# EAGLE design p8x-control-card (EAGLE 9.6.2)
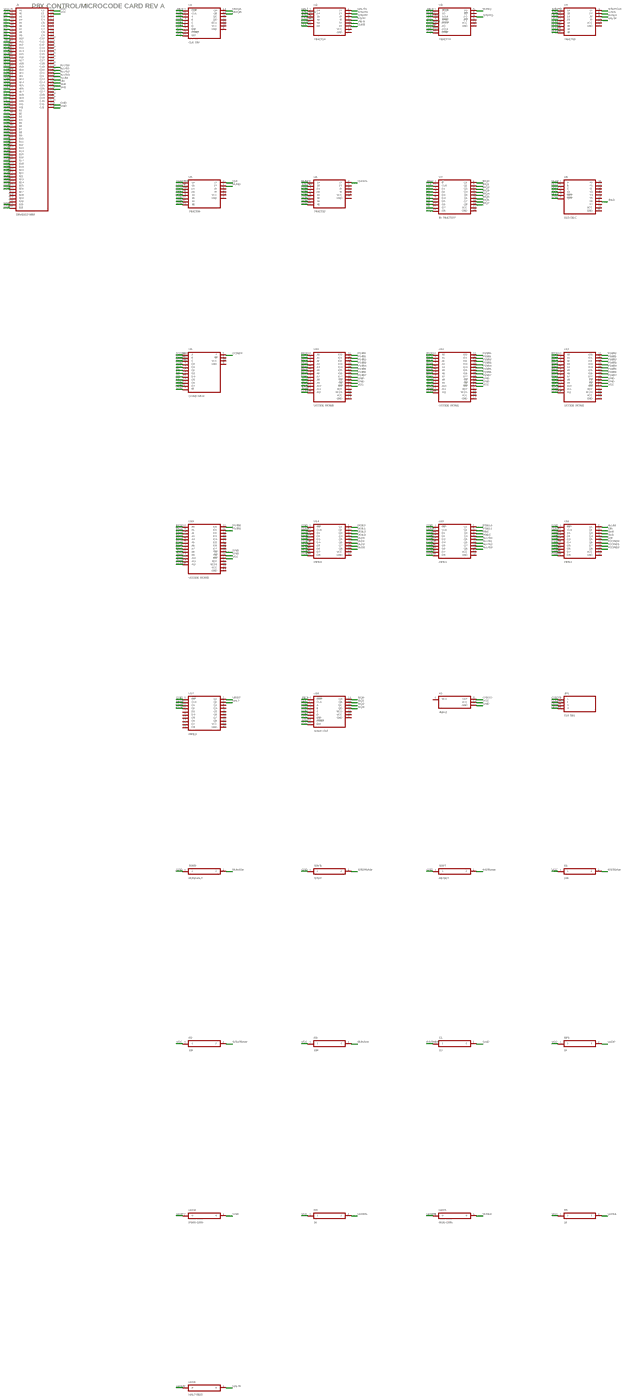
[diagram p0: schematic, sheet 1, overview]
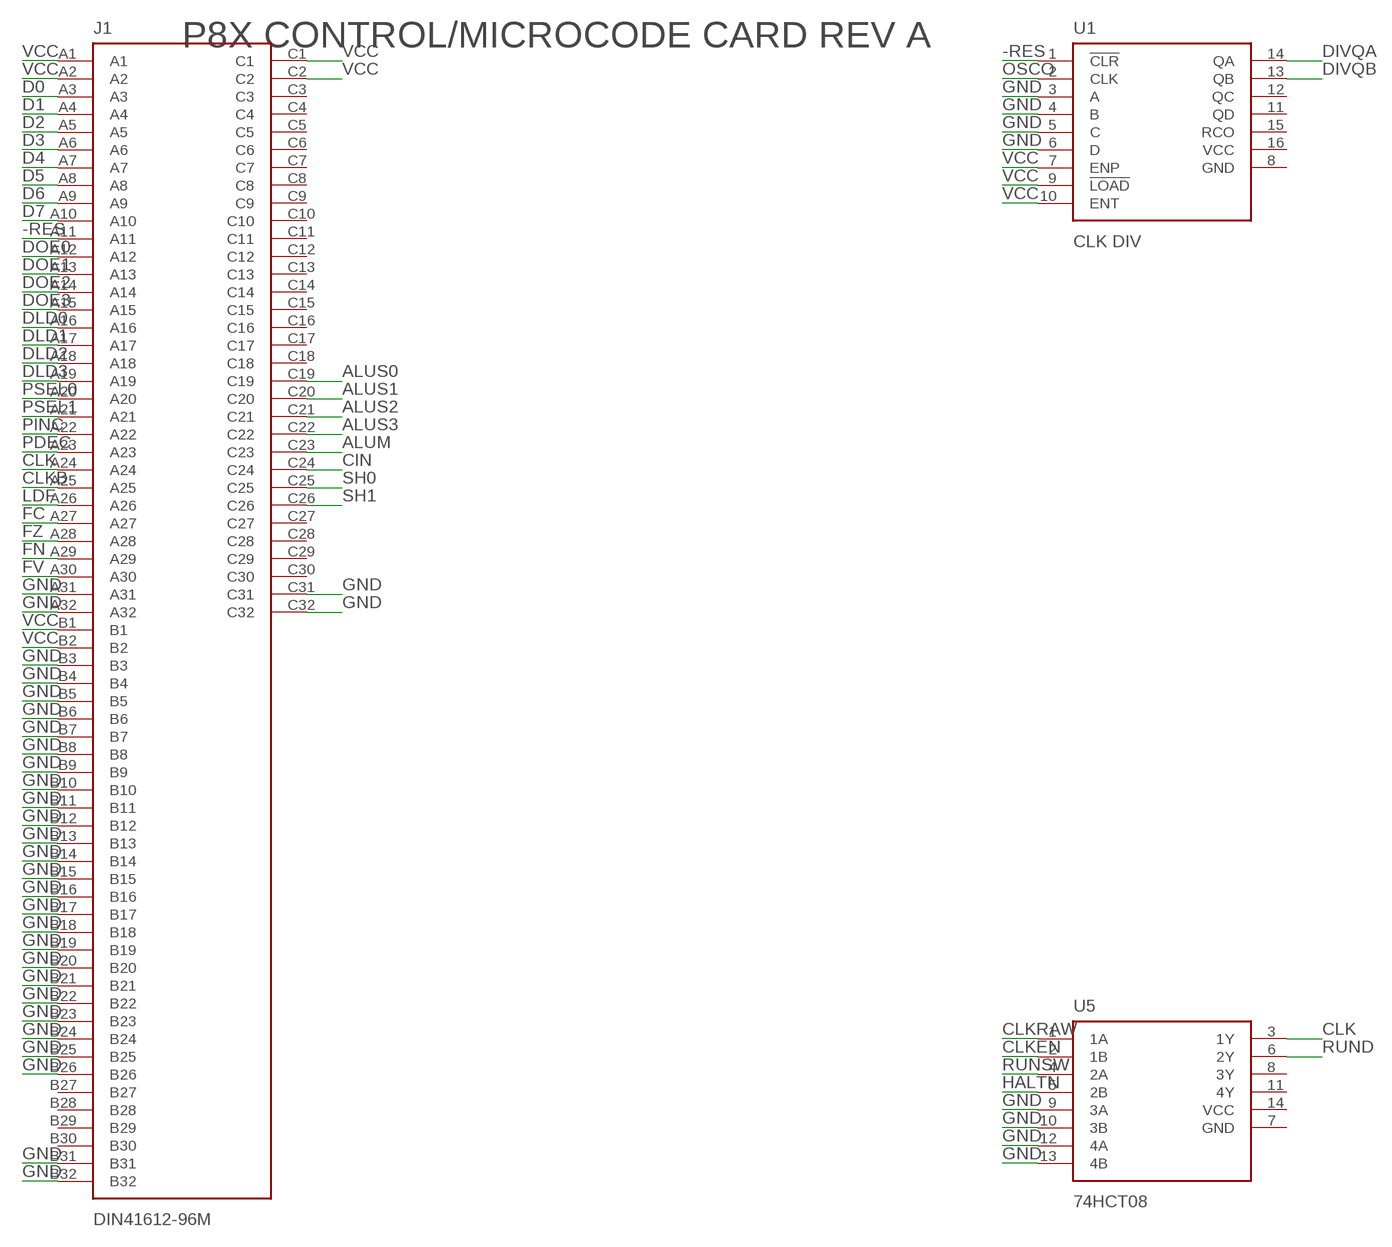
[diagram p1: schematic, sheet 1, part 1 of 5]
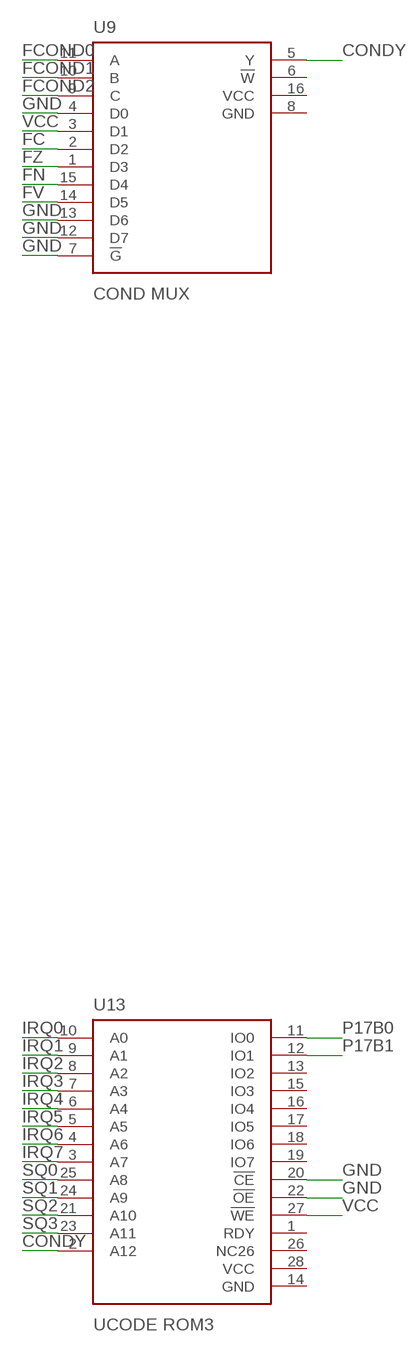
[diagram p2: schematic, sheet 1, part 2 of 5]
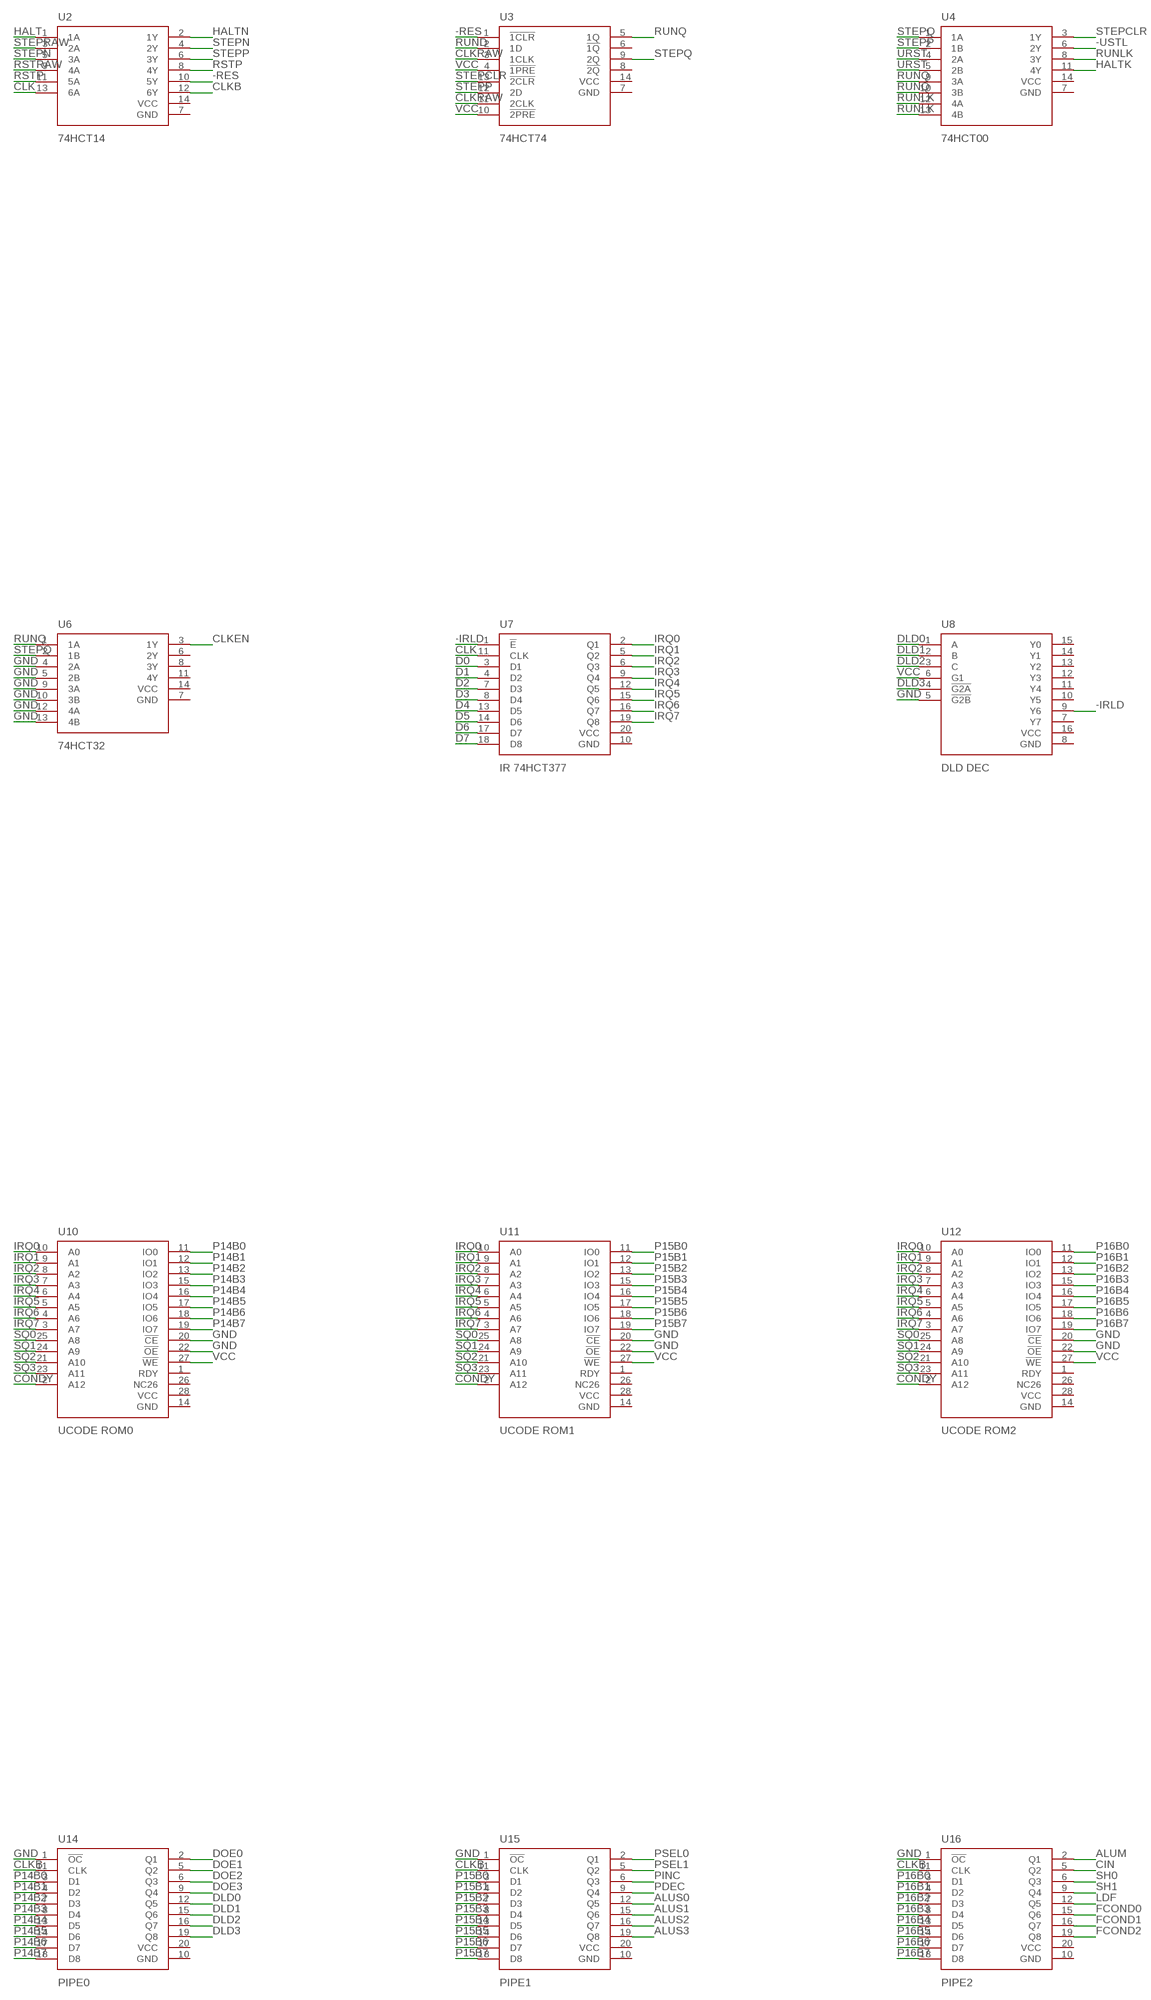
[diagram p3: schematic, sheet 1, part 3 of 5]
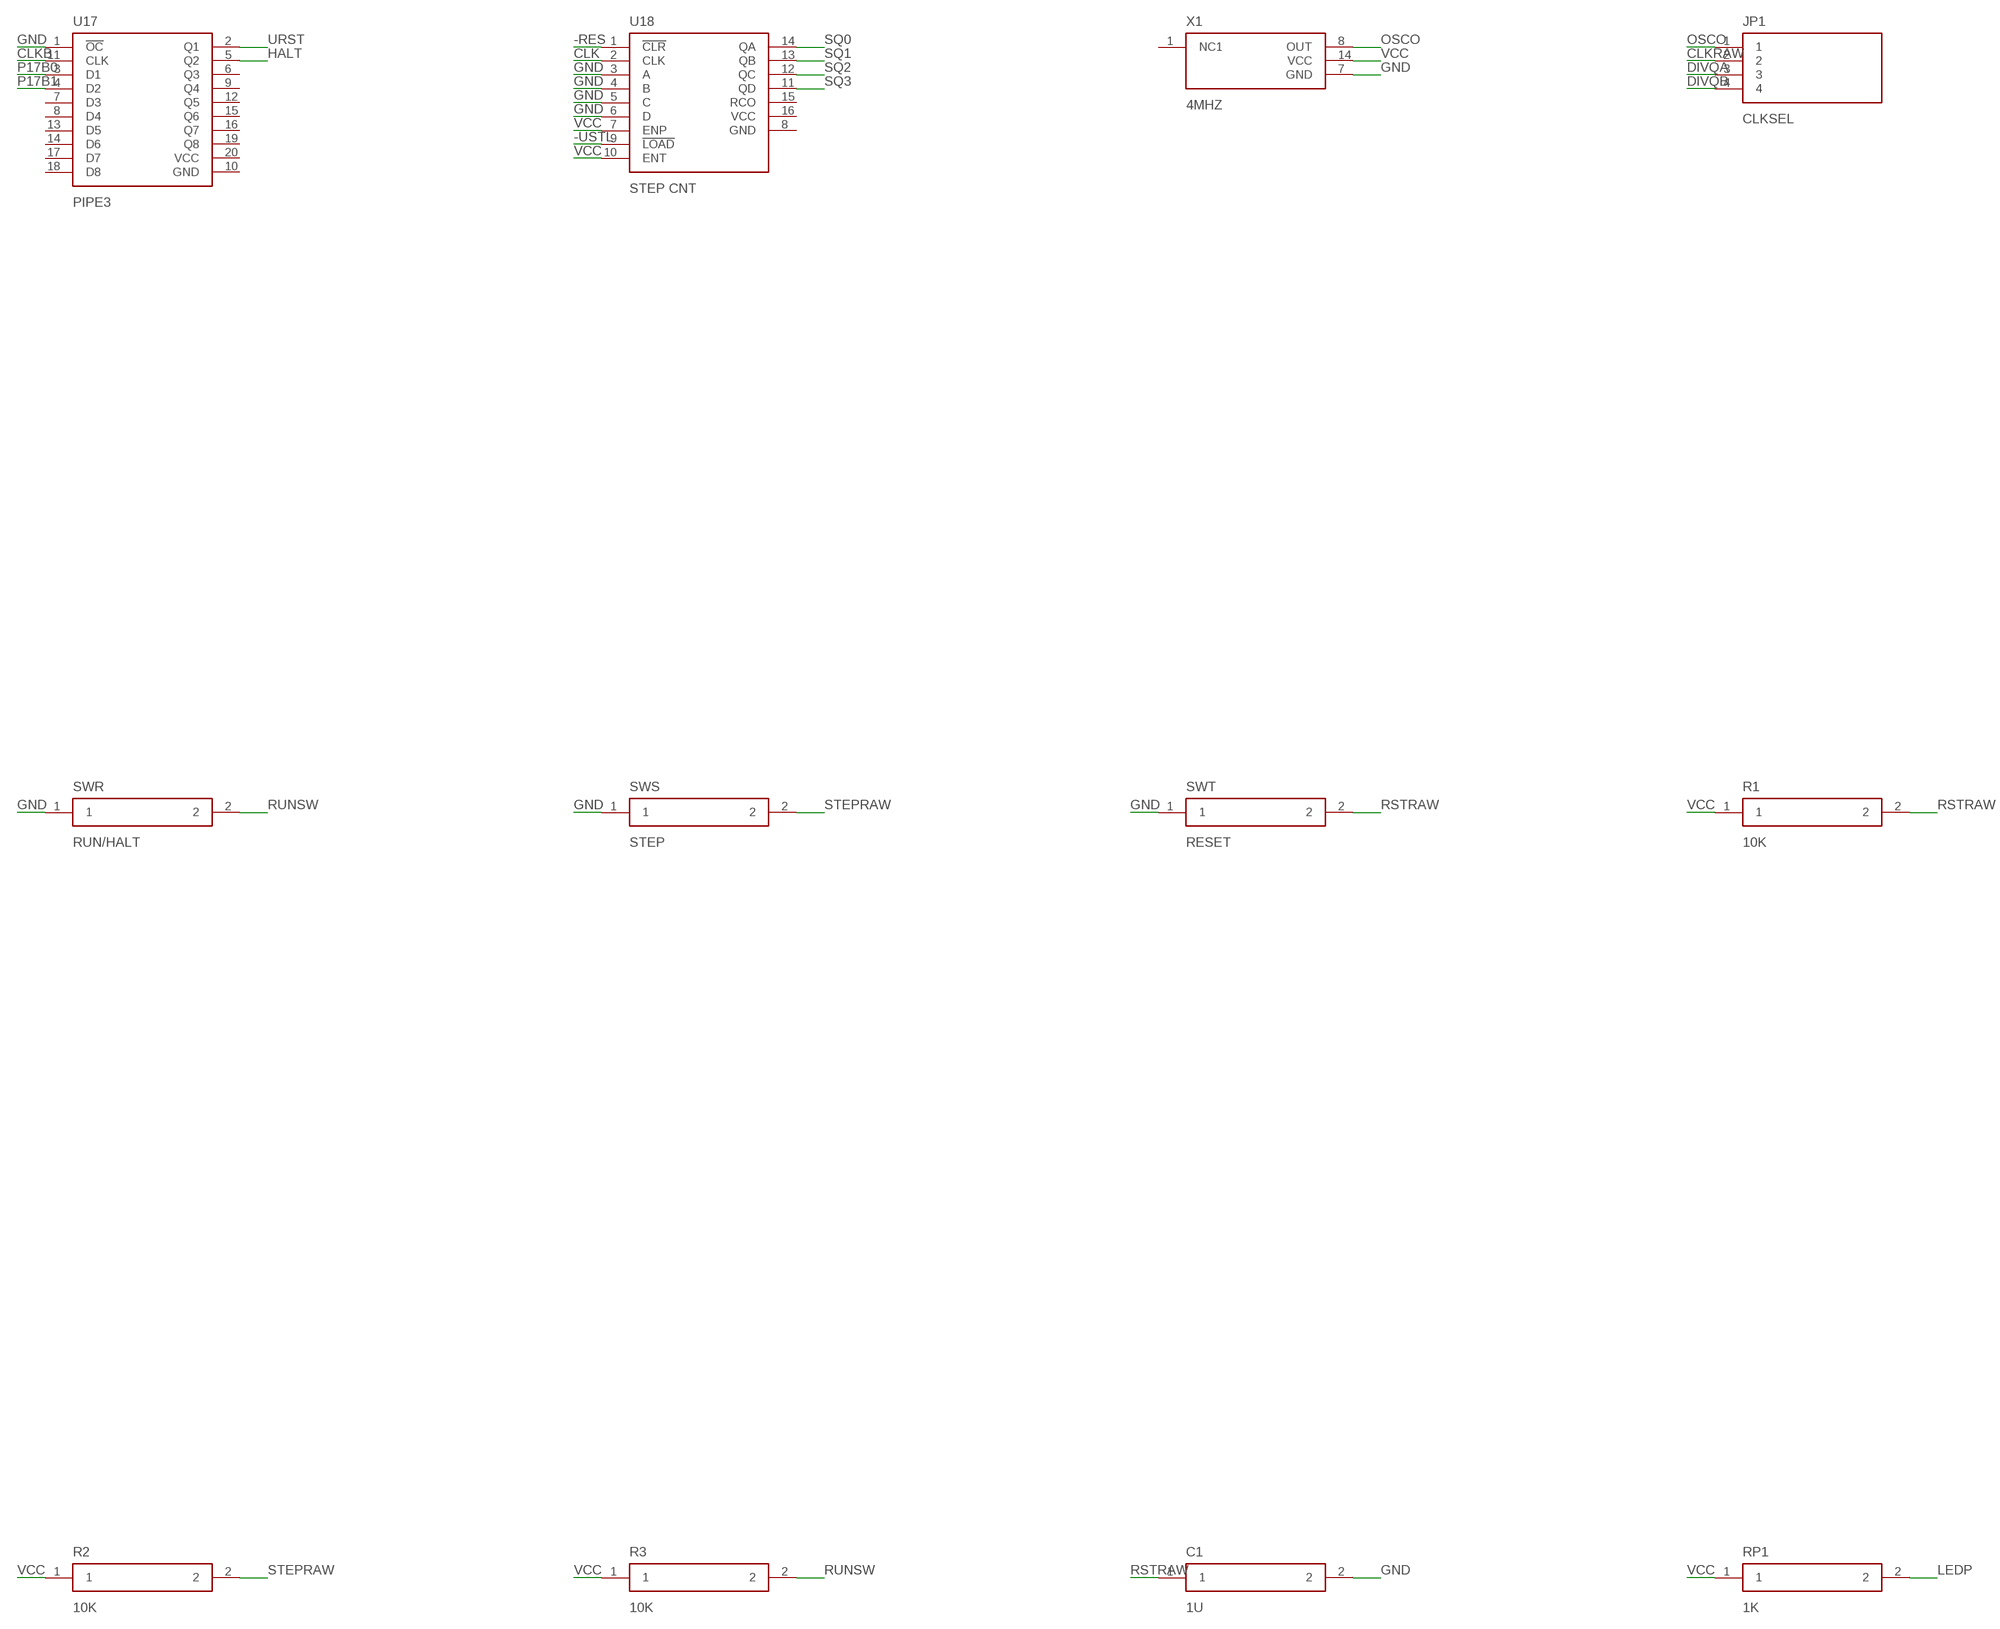
[diagram p4: schematic, sheet 1, part 4 of 5]
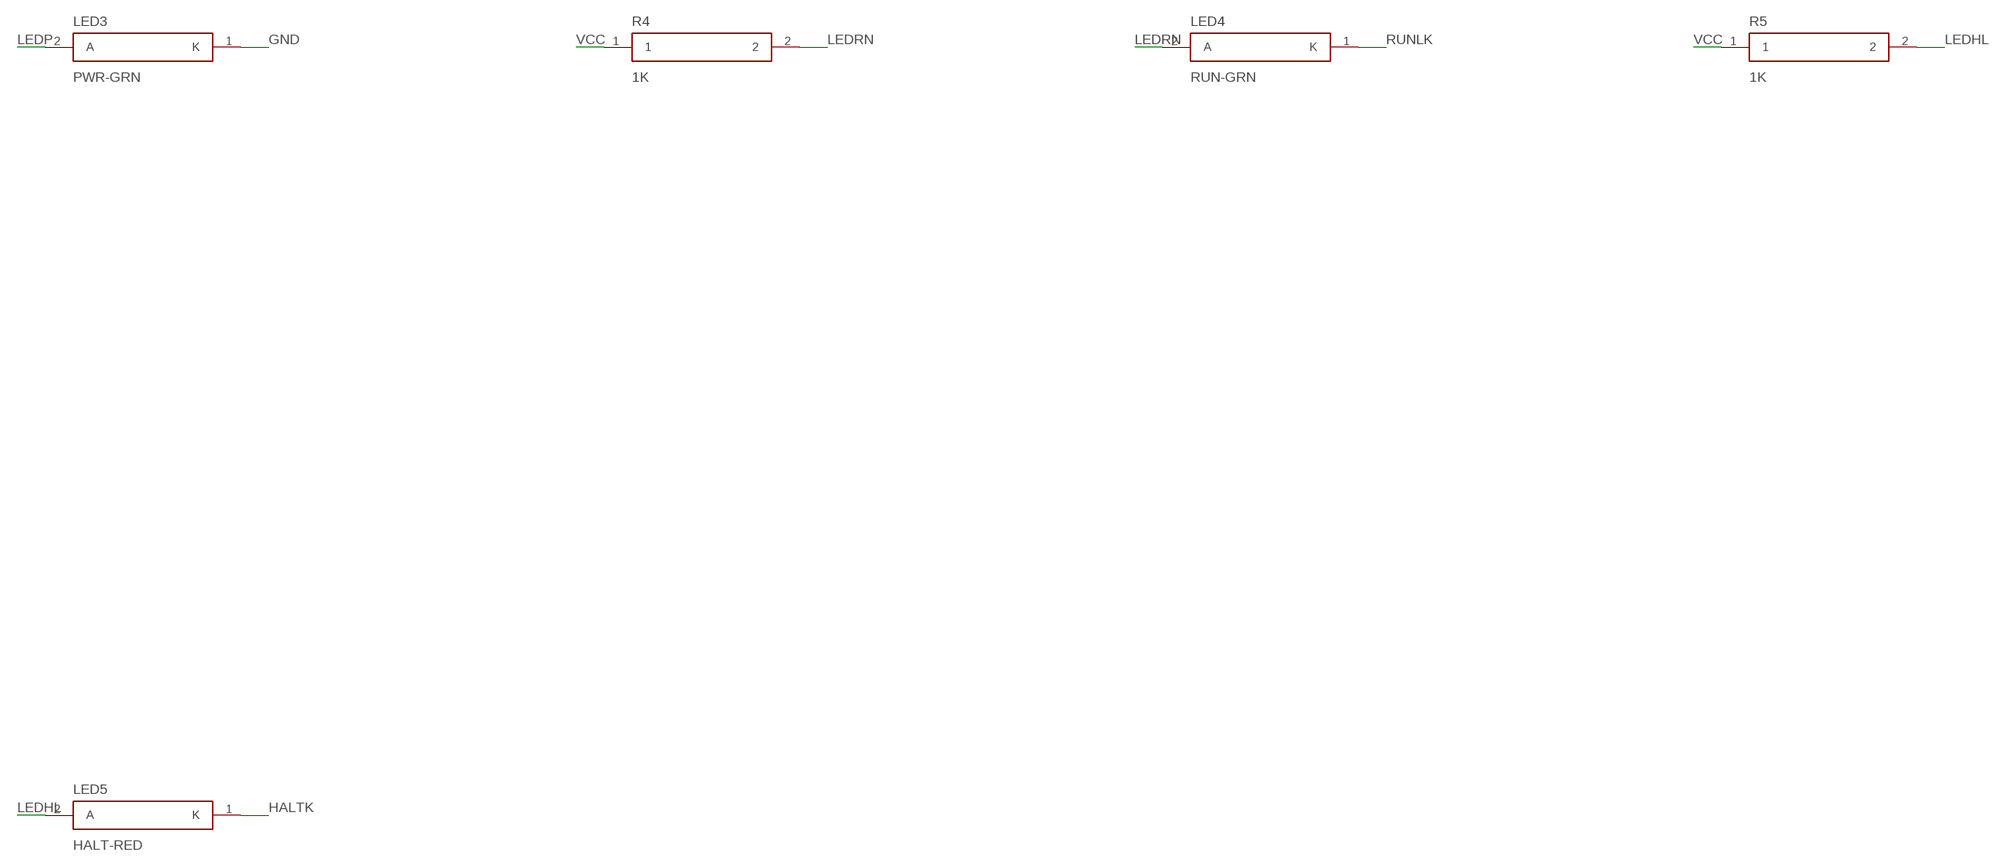
[diagram p5: schematic, sheet 1, part 5 of 5]

## Parts
C1  1U  CAP  [C_DISC]
J1  DIN41612-96M  DIN96  [DIN96]
JP1  CLKSEL  HDR4  [HDR4]
LED3  PWR-GRN  LED  [LED5]
LED4  RUN-GRN  LED  [LED5]
LED5  HALT-RED  LED  [LED5]
R1  10K  RES  [R_AXIAL]
R2  10K  RES  [R_AXIAL]
R3  10K  RES  [R_AXIAL]
R4  1K  RES  [R_AXIAL]
R5  1K  RES  [R_AXIAL]
RP1  1K  RES  [R_AXIAL]
SWR  RUN/HALT  SW2  [SW2P]
SWS  STEP  SW2  [SW2P]
SWT  RESET  SW2  [SW2P]
U1  CLK DIV  74161  [DIP16]
U2  74HCT14  HEX14  [DIP14]
U3  74HCT74  7474  [DIP14]
U4  74HCT00  GATES14  [DIP14]
U5  74HCT08  GATES14  [DIP14]
U6  74HCT32  GATES14  [DIP14]
U7  IR 74HCT377  74377V2  [DIP20]
U8  DLD DEC  74138  [DIP16]
U9  COND MUX  74151  [DIP16]
U10  UCODE ROM0  28C64  [DIP28W]
U11  UCODE ROM1  28C64  [DIP28W]
U12  UCODE ROM2  28C64  [DIP28W]
U13  UCODE ROM3  28C64  [DIP28W]
U14  PIPE0  74374  [DIP20]
U15  PIPE1  74374  [DIP20]
U16  PIPE2  74374  [DIP20]
U17  PIPE3  74374  [DIP20]
U18  STEP CNT  74161  [DIP16]
X1  4MHZ  OSC  [OSC4]

## Nets
-IRLD: U7.1(!E) U8.9(Y6)
-RES: J1.A11 U1.1(!CLR) U2.10(5Y) U3.1(!1CLR) U18.1(!CLR)
-USTL: U4.6(2Y) U18.9(!LOAD)
ALUM: J1.C23 U16.2(Q1)
ALUS0: J1.C19 U15.12(Q5)
ALUS1: J1.C20 U15.15(Q6)
ALUS2: J1.C21 U15.16(Q7)
ALUS3: J1.C22 U15.19(Q8)
CIN: J1.C24 U16.5(Q2)
CLK: J1.A24 U2.13(6A) U5.3(1Y) U7.11(CLK) U18.2(CLK)
CLKB: J1.A25 U2.12(6Y) U14.11(CLK) U15.11(CLK) U16.11(CLK) U17.11(CLK)
CLKEN: U5.2(1B) U6.3(1Y)
CLKRAW: JP1.2 U3.3(1CLK) U3.11(2CLK) U5.1(1A)
CONDY: U9.5(Y) U10.2(A12) U11.2(A12) U12.2(A12) U13.2(A12)
D0: J1.A3 U7.3(D1)
D1: J1.A4 U7.4(D2)
D2: J1.A5 U7.7(D3)
D3: J1.A6 U7.8(D4)
D4: J1.A7 U7.13(D5)
D5: J1.A8 U7.14(D6)
D6: J1.A9 U7.17(D7)
D7: J1.A10 U7.18(D8)
DIVQA: JP1.3 U1.14(QA)
DIVQB: JP1.4 U1.13(QB)
DLD0: J1.A16 U8.1(A) U14.12(Q5)
DLD1: J1.A17 U8.2(B) U14.15(Q6)
DLD2: J1.A18 U8.3(C) U14.16(Q7)
DLD3: J1.A19 U8.4(!G2A) U14.19(Q8)
DOE0: J1.A12 U14.2(Q1)
DOE1: J1.A13 U14.5(Q2)
DOE2: J1.A14 U14.6(Q3)
DOE3: J1.A15 U14.9(Q4)
FC: J1.A27 U9.2(D2)
FCOND0: U9.11(A) U16.15(Q6)
FCOND1: U9.10(B) U16.16(Q7)
FCOND2: U9.9(C) U16.19(Q8)
FN: J1.A29 U9.15(D4)
FV: J1.A30 U9.14(D5)
FZ: J1.A28 U9.1(D3)
GND: C1.2 J1.A31 J1.A32 J1.B3 J1.B4 J1.B5 J1.B6 J1.B7 J1.B8 J1.B9 J1.B10 J1.B11 J1.B12 J1.B13 J1.B14 J1.B15 J1.B16 J1.B17 J1.B18 J1.B19 J1.B20 J1.B21 J1.B22 J1.B23 J1.B24 J1.B25 J1.B26 J1.B31 J1.B32 J1.C31 J1.C32 LED3.1(K) SWR.1 SWS.1 SWT.1 U1.3(A) U1.4(B) U1.5(C) U1.6(D) U5.9(3A) U5.10(3B) U5.12(4A) U5.13(4B) U6.4(2A) U6.5(2B) U6.9(3A) U6.10(3B) U6.12(4A) U6.13(4B) U8.5(!G2B) U9.4(D0) U9.7(!G) U9.12(D7) U9.13(D6) U10.20(!CE) U10.22(!OE) U11.20(!CE) U11.22(!OE) U12.20(!CE) U12.22(!OE) U13.20(!CE) U13.22(!OE) U14.1(!OC) U15.1(!OC) U16.1(!OC) U17.1(!OC) U18.3(A) U18.4(B) U18.5(C) U18.6(D) X1.7(GND)
HALT: U2.1(1A) U17.5(Q2)
HALTK: LED5.1(K) U4.11(4Y)
HALTN: U2.2(1Y) U5.5(2B)
IRQ0: U7.2(Q1) U10.10(A0) U11.10(A0) U12.10(A0) U13.10(A0)
IRQ1: U7.5(Q2) U10.9(A1) U11.9(A1) U12.9(A1) U13.9(A1)
IRQ2: U7.6(Q3) U10.8(A2) U11.8(A2) U12.8(A2) U13.8(A2)
IRQ3: U7.9(Q4) U10.7(A3) U11.7(A3) U12.7(A3) U13.7(A3)
IRQ4: U7.12(Q5) U10.6(A4) U11.6(A4) U12.6(A4) U13.6(A4)
IRQ5: U7.15(Q6) U10.5(A5) U11.5(A5) U12.5(A5) U13.5(A5)
IRQ6: U7.16(Q7) U10.4(A6) U11.4(A6) U12.4(A6) U13.4(A6)
IRQ7: U7.19(Q8) U10.3(A7) U11.3(A7) U12.3(A7) U13.3(A7)
LDF: J1.A26 U16.12(Q5)
LEDHL: LED5.2(A) R5.2
LEDP: LED3.2(A) RP1.2
LEDRN: LED4.2(A) R4.2
OSCO: JP1.1 U1.2(CLK) X1.8(OUT)
P14B0: U10.11(IO0) U14.3(D1)
P14B1: U10.12(IO1) U14.4(D2)
P14B2: U10.13(IO2) U14.7(D3)
P14B3: U10.15(IO3) U14.8(D4)
P14B4: U10.16(IO4) U14.13(D5)
P14B5: U10.17(IO5) U14.14(D6)
P14B6: U10.18(IO6) U14.17(D7)
P14B7: U10.19(IO7) U14.18(D8)
P15B0: U11.11(IO0) U15.3(D1)
P15B1: U11.12(IO1) U15.4(D2)
P15B2: U11.13(IO2) U15.7(D3)
P15B3: U11.15(IO3) U15.8(D4)
P15B4: U11.16(IO4) U15.13(D5)
P15B5: U11.17(IO5) U15.14(D6)
P15B6: U11.18(IO6) U15.17(D7)
P15B7: U11.19(IO7) U15.18(D8)
P16B0: U12.11(IO0) U16.3(D1)
P16B1: U12.12(IO1) U16.4(D2)
P16B2: U12.13(IO2) U16.7(D3)
P16B3: U12.15(IO3) U16.8(D4)
P16B4: U12.16(IO4) U16.13(D5)
P16B5: U12.17(IO5) U16.14(D6)
P16B6: U12.18(IO6) U16.17(D7)
P16B7: U12.19(IO7) U16.18(D8)
P17B0: U13.11(IO0) U17.3(D1)
P17B1: U13.12(IO1) U17.4(D2)
PDEC: J1.A23 U15.9(Q4)
PINC: J1.A22 U15.6(Q3)
PSEL0: J1.A20 U15.2(Q1)
PSEL1: J1.A21 U15.5(Q2)
RSTP: U2.8(4Y) U2.11(5A)
RSTRAW: C1.1 R1.2 SWT.2 U2.9(4A)
RUND: U3.2(1D) U5.6(2Y)
RUNLK: LED4.1(K) U4.8(3Y) U4.12(4A) U4.13(4B)
RUNQ: U3.5(1Q) U4.9(3A) U4.10(3B) U6.1(1A)
RUNSW: R3.2 SWR.2 U5.4(2A)
SH0: J1.C25 U16.6(Q3)
SH1: J1.C26 U16.9(Q4)
SQ0: U10.25(A8) U11.25(A8) U12.25(A8) U13.25(A8) U18.14(QA)
SQ1: U10.24(A9) U11.24(A9) U12.24(A9) U13.24(A9) U18.13(QB)
SQ2: U10.21(A10) U11.21(A10) U12.21(A10) U13.21(A10) U18.12(QC)
SQ3: U10.23(A11) U11.23(A11) U12.23(A11) U13.23(A11) U18.11(QD)
STEPCLR: U3.13(!2CLR) U4.3(1Y)
STEPN: U2.4(2Y) U2.5(3A)
STEPP: U2.6(3Y) U3.12(2D) U4.2(1B)
STEPQ: U3.9(2Q) U4.1(1A) U6.2(1B)
STEPRAW: R2.2 SWS.2 U2.3(2A)
URST: U4.4(2A) U4.5(2B) U17.2(Q1)
VCC: J1.A1 J1.A2 J1.B1 J1.B2 J1.C1 J1.C2 R1.1 R2.1 R3.1 R4.1 R5.1 RP1.1 U1.7(ENP) U1.9(!LOAD) U1.10(ENT) U3.4(!1PRE) U3.10(!2PRE) U8.6(G1) U9.3(D1) U10.27(!WE) U11.27(!WE) U12.27(!WE) U13.27(!WE) U18.7(ENP) U18.10(ENT) X1.14(VCC)
Unconnected: J1.B27 J1.B28 J1.B29 J1.B30 J1.C3 J1.C4 J1.C5 J1.C6 J1.C7 J1.C8 J1.C9 J1.C10 J1.C11 J1.C12 J1.C13 J1.C14 J1.C15 J1.C16 J1.C17 J1.C18 J1.C27 J1.C28 J1.C29 J1.C30 U1.8(GND) U1.11(QD) U1.12(QC) U1.15(RCO) U1.16(VCC) U2.7(GND) U2.14(VCC) U3.6(!1Q) U3.7(GND) U3.8(!2Q) U3.14(VCC) U4.7(GND) U4.14(VCC) U5.7(GND) U5.8(3Y) U5.11(4Y) U5.14(VCC) U6.6(2Y) U6.7(GND) U6.8(3Y) U6.11(4Y) U6.14(VCC) U7.10(GND) U7.20(VCC) U8.7(Y7) U8.8(GND) U8.10(Y5) U8.11(Y4) U8.12(Y3) U8.13(Y2) U8.14(Y1) U8.15(Y0) U8.16(VCC) U9.6(!W) U9.8(GND) U9.16(VCC) U10.1(RDY) U10.14(GND) U10.26(NC26) U10.28(VCC) U11.1(RDY) U11.14(GND) U11.26(NC26) U11.28(VCC) U12.1(RDY) U12.14(GND) U12.26(NC26) U12.28(VCC) U13.1(RDY) U13.13(IO2) U13.14(GND) U13.15(IO3) U13.16(IO4) U13.17(IO5) U13.18(IO6) U13.19(IO7) U13.26(NC26) U13.28(VCC) U14.10(GND) U14.20(VCC) U15.10(GND) U15.20(VCC) U16.10(GND) U16.20(VCC) U17.6(Q3) U17.7(D3) U17.8(D4) U17.9(Q4) U17.10(GND) U17.12(Q5) U17.13(D5) U17.14(D6) U17.15(Q6) U17.16(Q7) U17.17(D7) U17.18(D8) U17.19(Q8) U17.20(VCC) U18.8(GND) U18.15(RCO) U18.16(VCC) X1.1(NC1)

## Notes on the sheet
- P8X CONTROL/MICROCODE CARD REV A

## Library data of the parts
C1 = p8x:CAP
J1 = p8x:DIN96
JP1 = p8x:HDR4
LED3-LED5 = p8x:LED
R1-R5 RP1 = p8x:RES
SWR SWS SWT = p8x:SW2
U1 U18 = p8x:74161
U2 = p8x:HEX14
U3 = p8x:7474
U4-U6 = p8x:GATES14
U7 = p8x:74377V2
U8 = p8x:74138
U9 = p8x:74151
U10-U13 = p8x:28C64
U14-U17 = p8x:74374
X1 = p8x:OSC

## Board
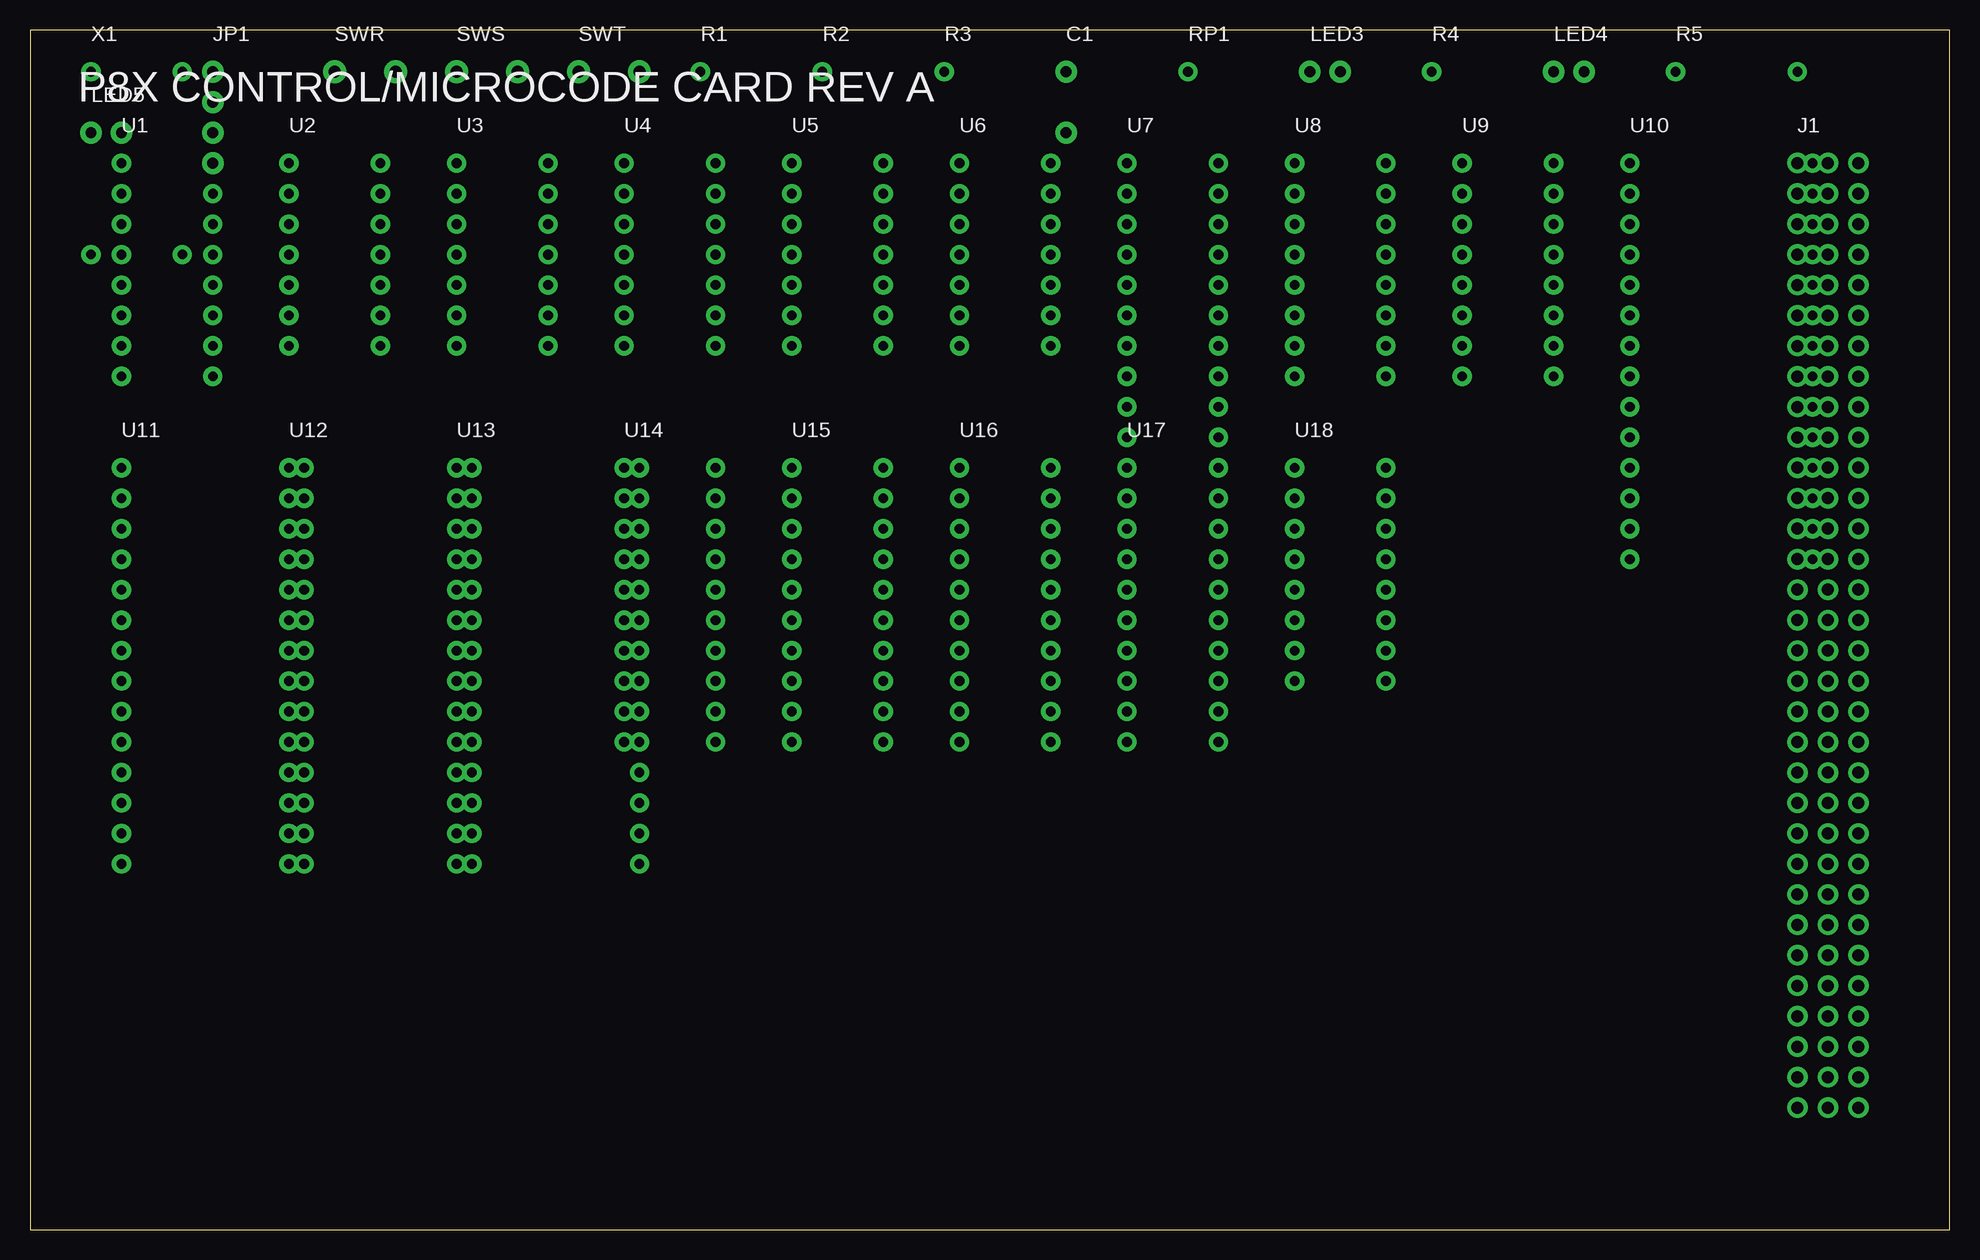
[diagram p6: board, top side]
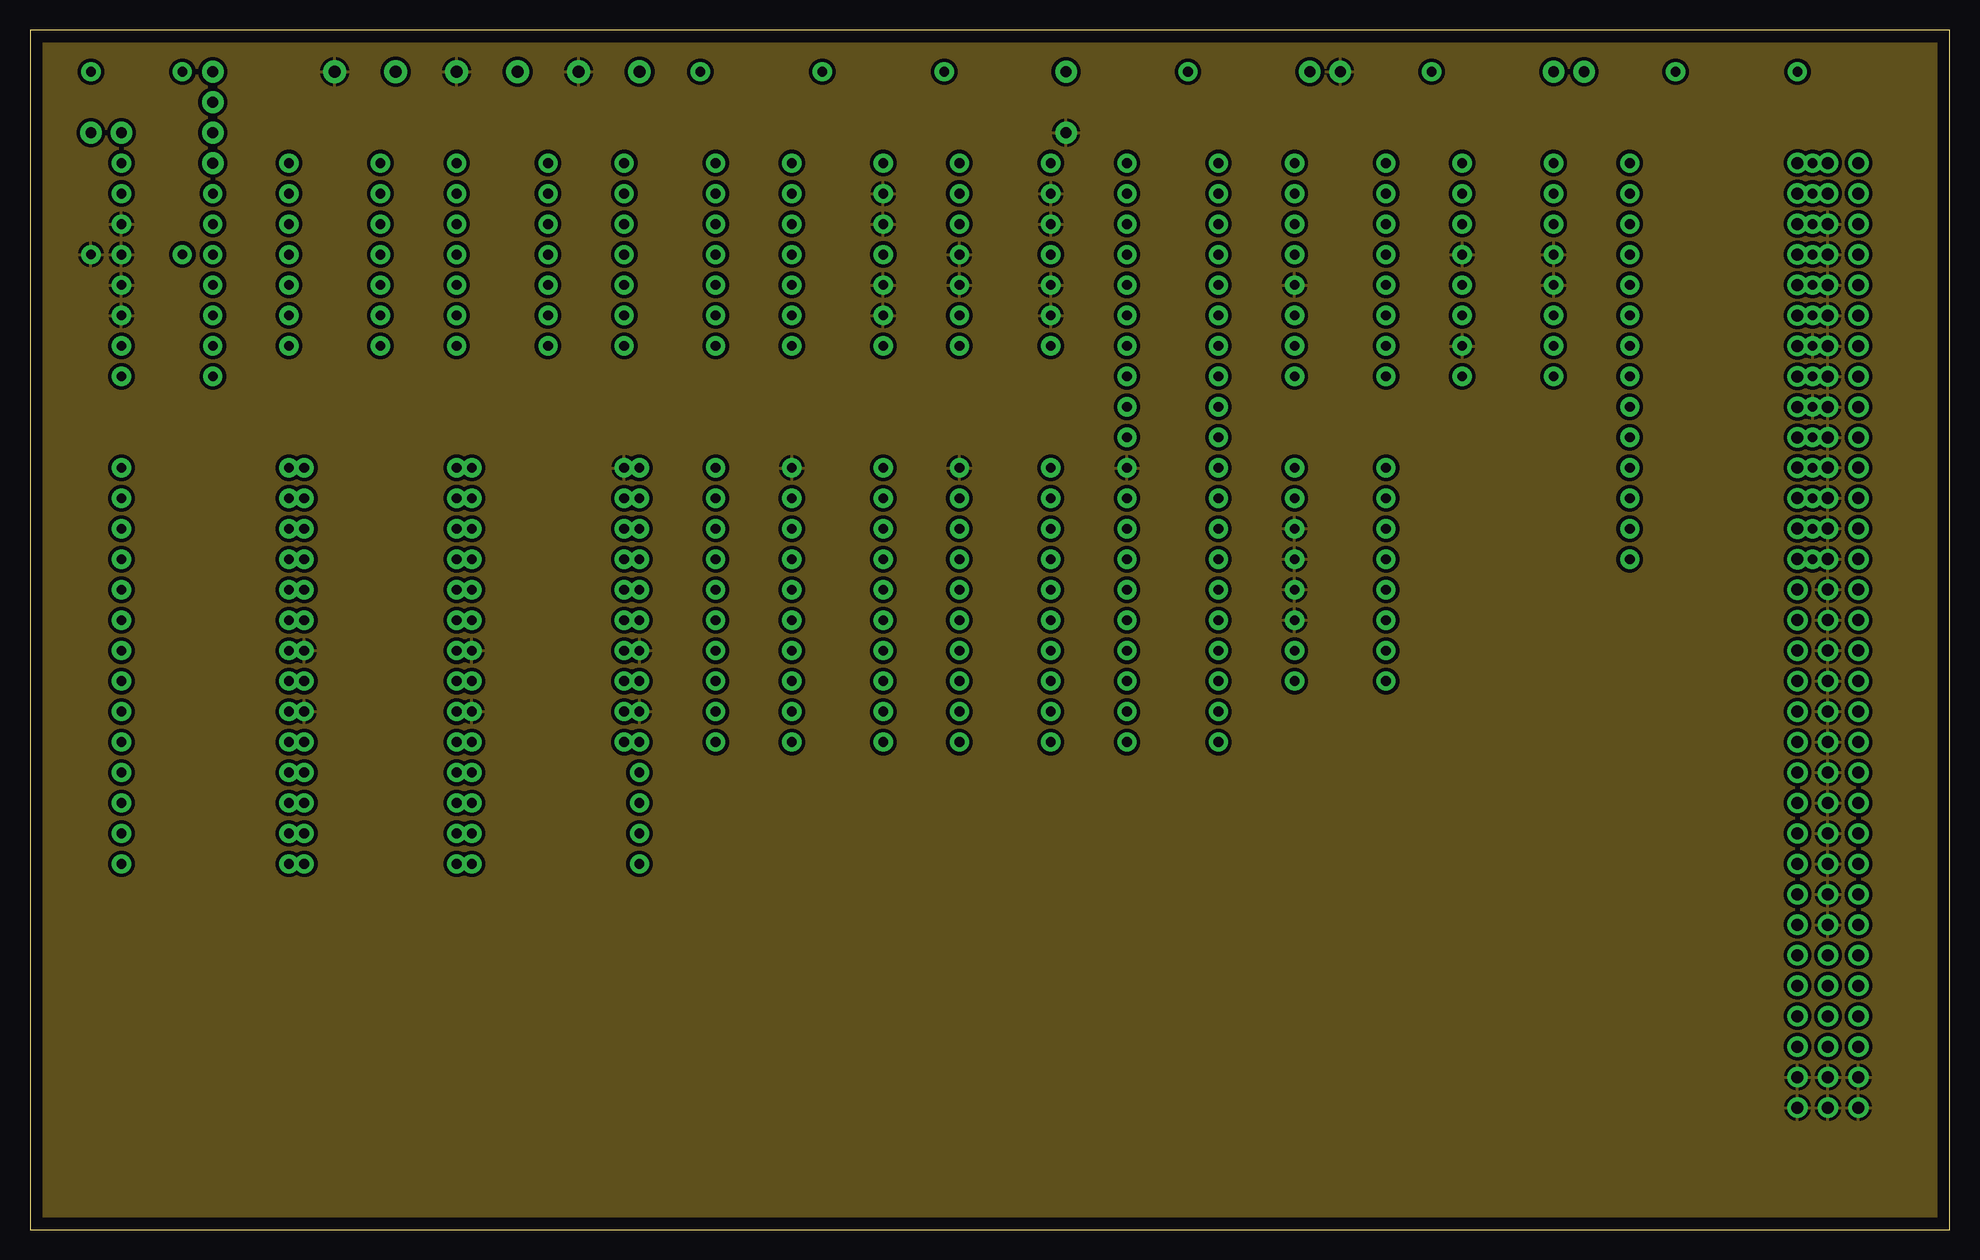
[diagram p7: board, inner layer Route2]
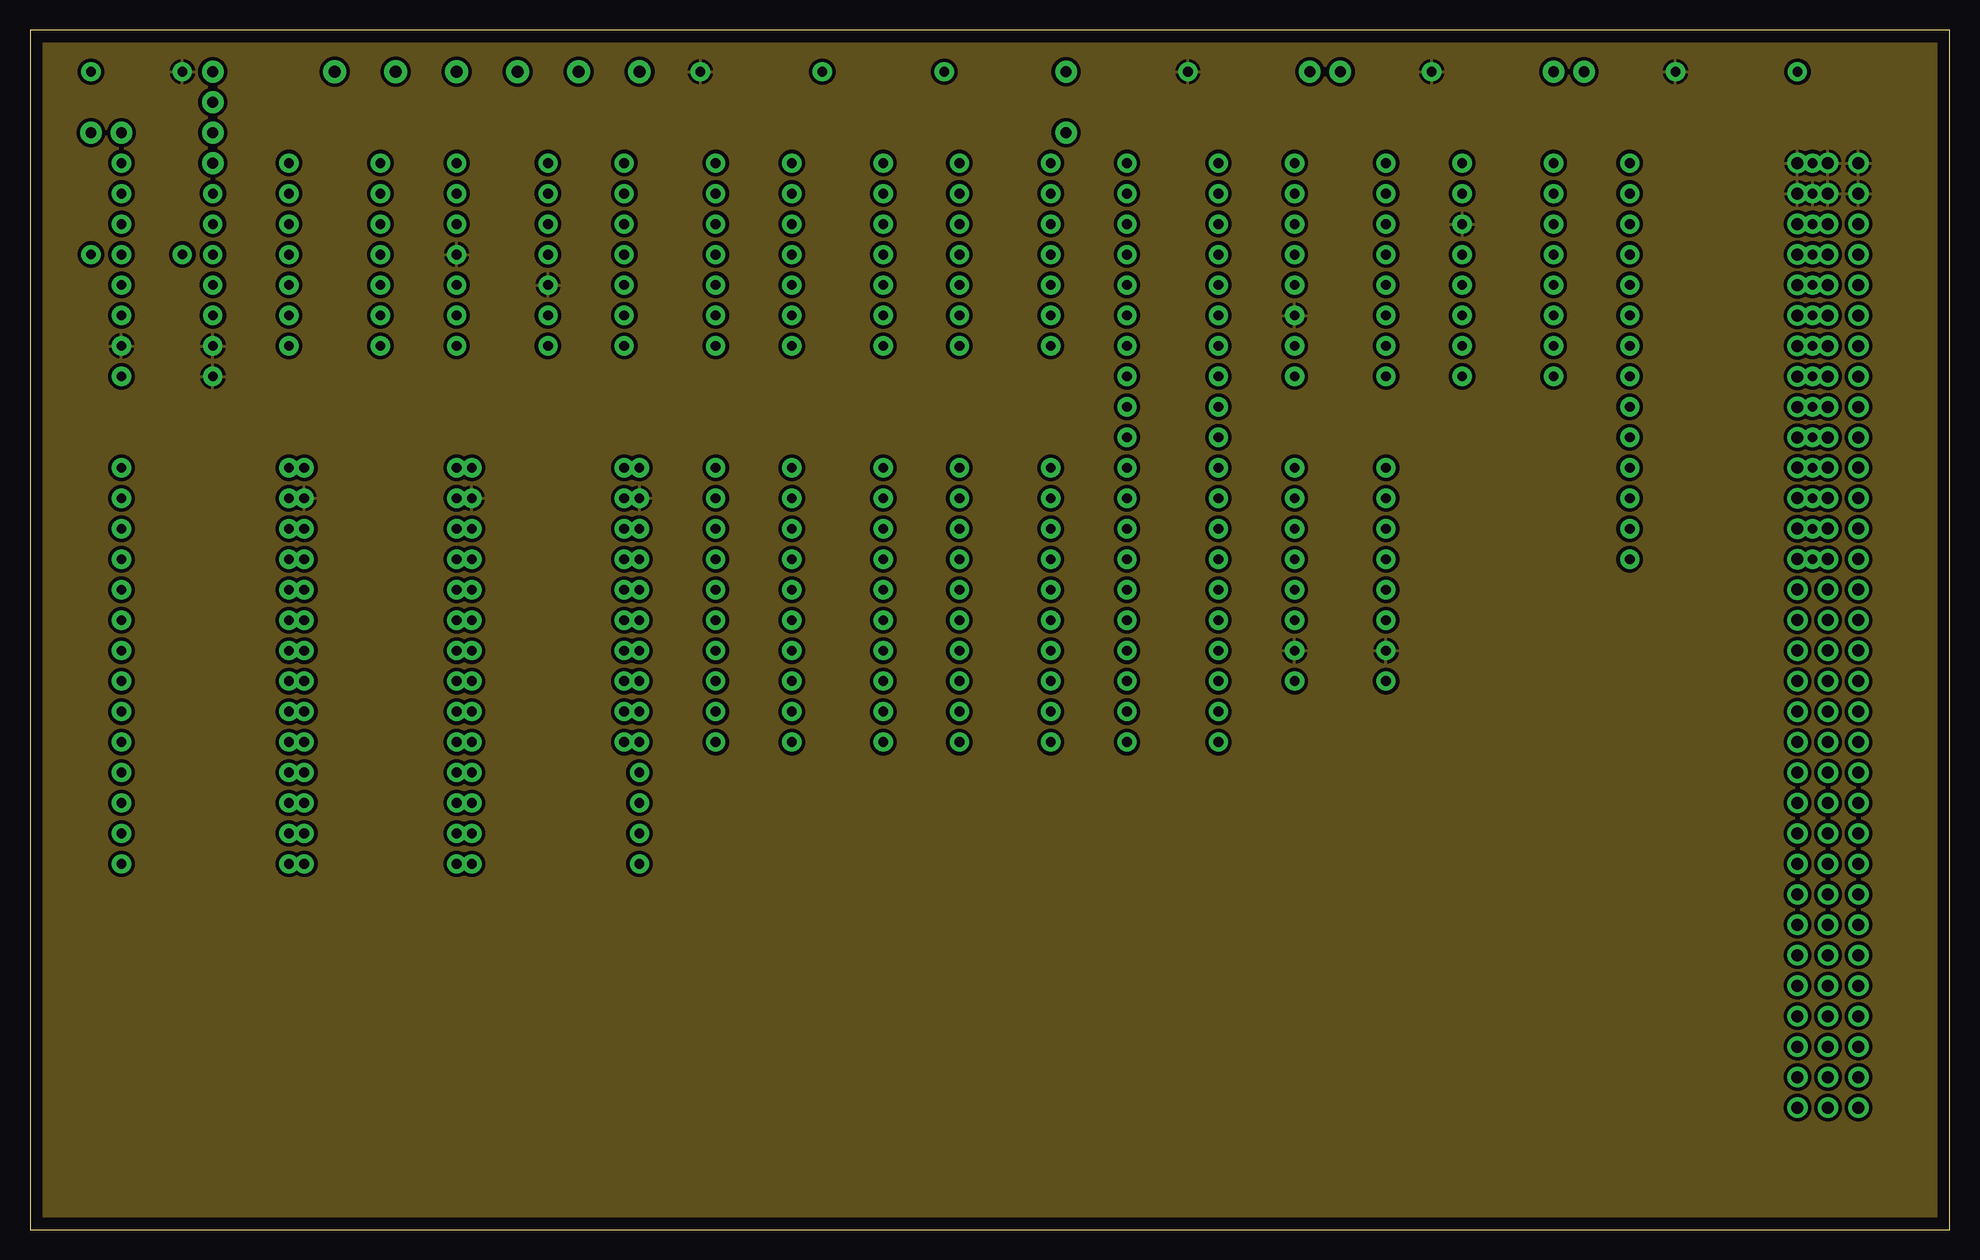
[diagram p8: board, inner layer Route15]

Size 160 x 100 mm. Coordinates in mm from the lower left corner, seen from the top.
Outline: 0,0 160,0 160,100 0,100 0,0
Copper layers (1*2*15*16): Top / Route2 / Route15 / Bottom

### Footprints (pad centres in the part's own frame; a part is rotated, then mirrored left to right if it is on the bottom)
C_DISC = drill 0.9 pad 1.8: 1 0,0; 2 0,-5.08
DIN96 = drill 1 pad 1.7: A1 5.08,0; A2 5.08,-2.54; A3 5.08,-5.08; A4 5.08,-7.62; A5 5.08,-10.16; A6 5.08,-12.7; A7 5.08,-15.24; A8 5.08,-17.78; A9 5.08,-20.32; A10 5.08,-22.86; A11 5.08,-25.4; A12 5.08,-27.94; A13 5.08,-30.48; A14 5.08,-33.02; A15 5.08,-35.56; A16 5.08,-38.1; A17 5.08,-40.64; A18 5.08,-43.18; A19 5.08,-45.72; A20 5.08,-48.26; A21 5.08,-50.8; A22 5.08,-53.34; A23 5.08,-55.88; A24 5.08,-58.42; A25 5.08,-60.96; A26 5.08,-63.5; A27 5.08,-66.04; A28 5.08,-68.58; A29 5.08,-71.12; A30 5.08,-73.66; A31 5.08,-76.2; A32 5.08,-78.74; B1 2.54,0; B2 2.54,-2.54; B3 2.54,-5.08; B4 2.54,-7.62; B5 2.54,-10.16; B6 2.54,-12.7; B7 2.54,-15.24; B8 2.54,-17.78; B9 2.54,-20.32; B10 2.54,-22.86; B11 2.54,-25.4; B12 2.54,-27.94; B13 2.54,-30.48; B14 2.54,-33.02; B15 2.54,-35.56; B16 2.54,-38.1; B17 2.54,-40.64; B18 2.54,-43.18; B19 2.54,-45.72; B20 2.54,-48.26; B21 2.54,-50.8; B22 2.54,-53.34; B23 2.54,-55.88; B24 2.54,-58.42; B25 2.54,-60.96; B26 2.54,-63.5; B27 2.54,-66.04; B28 2.54,-68.58; B29 2.54,-71.12; B30 2.54,-73.66; B31 2.54,-76.2; B32 2.54,-78.74; C1 0,0; C2 0,-2.54; C3 0,-5.08; C4 0,-7.62; C5 0,-10.16; C6 0,-12.7; C7 0,-15.24; C8 0,-17.78; C9 0,-20.32; C10 0,-22.86; C11 0,-25.4; C12 0,-27.94; C13 0,-30.48; C14 0,-33.02; C15 0,-35.56; C16 0,-38.1; C17 0,-40.64; C18 0,-43.18; C19 0,-45.72; C20 0,-48.26; C21 0,-50.8; C22 0,-53.34; C23 0,-55.88; C24 0,-58.42; C25 0,-60.96; C26 0,-63.5; C27 0,-66.04; C28 0,-68.58; C29 0,-71.12; C30 0,-73.66; C31 0,-76.2; C32 0,-78.74
HDR4 = drill 0.9 pad 1.8: 1 0,0; 2 0,-2.54; 3 0,-5.08; 4 0,-7.62
LED5 = drill 0.9 pad 1.8: 1 2.54,0; 2 0,0
R_AXIAL = drill 0.8 pad 1.6: 1 0,0; 2 10.16,0
SW2P = drill 1 pad 1.9: 1 0,0; 2 5.08,0
DIP16 = drill 0.813 pad 1.6: 1 0,0; 2 0,-2.54; 3 0,-5.08; 4 0,-7.62; 5 0,-10.16; 6 0,-12.7; 7 0,-15.24; 8 0,-17.78; 9 7.62,-17.78; 10 7.62,-15.24; 11 7.62,-12.7; 12 7.62,-10.16; 13 7.62,-7.62; 14 7.62,-5.08; 15 7.62,-2.54; 16 7.62,0
DIP14 = drill 0.813 pad 1.6: 1 0,0; 2 0,-2.54; 3 0,-5.08; 4 0,-7.62; 5 0,-10.16; 6 0,-12.7; 7 0,-15.24; 8 7.62,-15.24; 9 7.62,-12.7; 10 7.62,-10.16; 11 7.62,-7.62; 12 7.62,-5.08; 13 7.62,-2.54; 14 7.62,0
DIP20 = drill 0.813 pad 1.6: 1 0,0; 2 0,-2.54; 3 0,-5.08; 4 0,-7.62; 5 0,-10.16; 6 0,-12.7; 7 0,-15.24; 8 0,-17.78; 9 0,-20.32; 10 0,-22.86; 11 7.62,-22.86; 12 7.62,-20.32; 13 7.62,-17.78; 14 7.62,-15.24; 15 7.62,-12.7; 16 7.62,-10.16; 17 7.62,-7.62; 18 7.62,-5.08; 19 7.62,-2.54; 20 7.62,0
DIP28W = drill 0.813 pad 1.6: 1 0,0; 2 0,-2.54; 3 0,-5.08; 4 0,-7.62; 5 0,-10.16; 6 0,-12.7; 7 0,-15.24; 8 0,-17.78; 9 0,-20.32; 10 0,-22.86; 11 0,-25.4; 12 0,-27.94; 13 0,-30.48; 14 0,-33.02; 15 15.24,-33.02; 16 15.24,-30.48; 17 15.24,-27.94; 18 15.24,-25.4; 19 15.24,-22.86; 20 15.24,-20.32; 21 15.24,-17.78; 22 15.24,-15.24; 23 15.24,-12.7; 24 15.24,-10.16; 25 15.24,-7.62; 26 15.24,-5.08; 27 15.24,-2.54; 28 15.24,0
OSC4 = drill 0.8 pad 1.6: 1 0,0; 7 0,-15.24; 8 7.62,-15.24; 14 7.62,0

### Placement (x,y rotation side)
C1  86.36,96.52 0 top
J1  147.32,88.9 0 top
JP1  15.24,96.52 0 top
LED3  106.68,96.52 0 top
LED4  127,96.52 0 top
LED5  5.08,91.44 0 top
R1  55.88,96.52 0 top
R2  66.04,96.52 0 top
R3  76.2,96.52 0 top
R4  116.84,96.52 0 top
R5  137.16,96.52 0 top
RP1  96.52,96.52 0 top
SWR  25.4,96.52 0 top
SWS  35.56,96.52 0 top
SWT  45.72,96.52 0 top
U1  7.62,88.9 0 top
U2  21.59,88.9 0 top
U3  35.56,88.9 0 top
U4  49.53,88.9 0 top
U5  63.5,88.9 0 top
U6  77.47,88.9 0 top
U7  91.44,88.9 0 top
U8  105.41,88.9 0 top
U9  119.38,88.9 0 top
U10  133.35,88.9 0 top
U11  7.62,63.5 0 top
U12  21.59,63.5 0 top
U13  35.56,63.5 0 top
U14  49.53,63.5 0 top
U15  63.5,63.5 0 top
U16  77.47,63.5 0 top
U17  91.44,63.5 0 top
U18  105.41,63.5 0 top
X1  5.08,96.52 0 top

### Tracks (layer width: path | path; a pad name or v marks a point on that pad's centre or on a via)
GND
  pour Route2 (isolate 0.3): 0,0 160,0 160,100 0,100
VCC
  pour Route15 (isolate 0.3): 0,0 160,0 160,100 0,100

### Text on the board
tPlace: P8X CONTROL/MICROCODE CARD REV A